# Altium schematic sheet TK510_Spenningsforsyninger.SchDoc
size A3
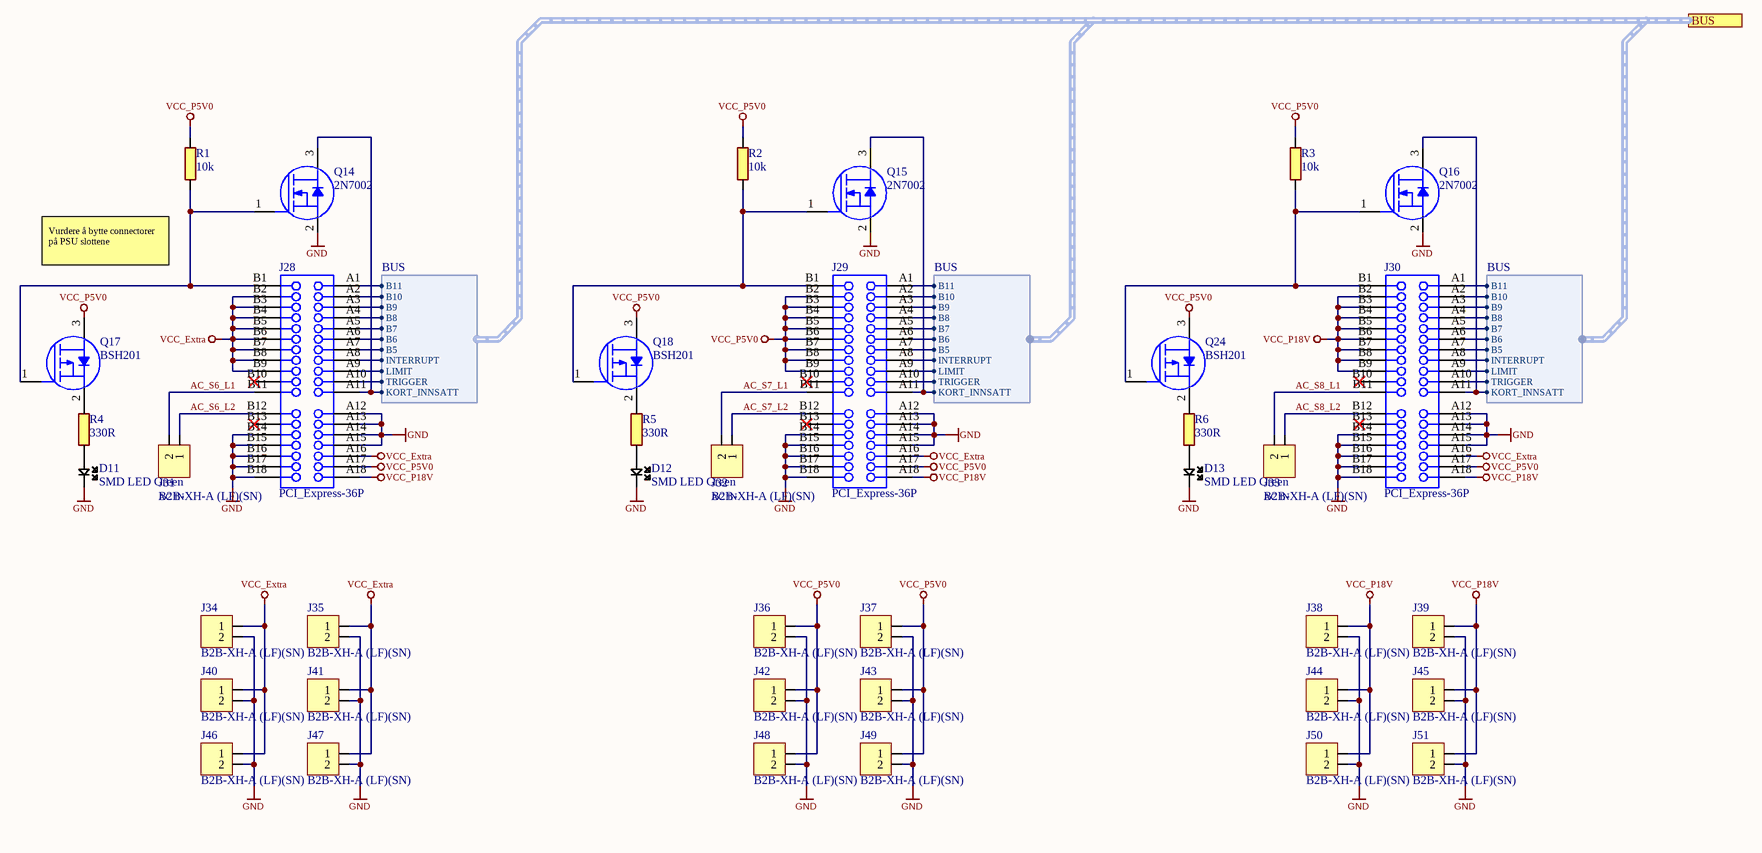
[diagram p0: TK510_Spenningsforsyninger.SchDoc]

## Parts
D11  SMD LED Green  [I_LEDC0603(1608)_N]
D12  SMD LED Green  [I_LEDC0603(1608)_N]
D13  SMD LED Green  [I_LEDC0603(1608)_N]
J28  PCI_Express-36P  [PCI_Express-36P]
J29  PCI_Express-36P  [PCI_Express-36P]
J30  PCI_Express-36P  [PCI_Express-36P]
J31  B2B-XH-A (LF)(SN)  [JST_2P]
J32  B2B-XH-A (LF)(SN)  [JST_2P]
J33  B2B-XH-A (LF)(SN)  [JST_2P]
J34  B2B-XH-A (LF)(SN)  [JST_2P]
J35  B2B-XH-A (LF)(SN)  [JST_2P]
J36  B2B-XH-A (LF)(SN)  [JST_2P]
J37  B2B-XH-A (LF)(SN)  [JST_2P]
J38  B2B-XH-A (LF)(SN)  [JST_2P]
J39  B2B-XH-A (LF)(SN)  [JST_2P]
J40  B2B-XH-A (LF)(SN)  [JST_2P]
J41  B2B-XH-A (LF)(SN)  [JST_2P]
J42  B2B-XH-A (LF)(SN)  [JST_2P]
J43  B2B-XH-A (LF)(SN)  [JST_2P]
J44  B2B-XH-A (LF)(SN)  [JST_2P]
J45  B2B-XH-A (LF)(SN)  [JST_2P]
J46  B2B-XH-A (LF)(SN)  [JST_2P]
J47  B2B-XH-A (LF)(SN)  [JST_2P]
J48  B2B-XH-A (LF)(SN)  [JST_2P]
J49  B2B-XH-A (LF)(SN)  [JST_2P]
J50  B2B-XH-A (LF)(SN)  [JST_2P]
J51  B2B-XH-A (LF)(SN)  [JST_2P]
Q14  2N7002  [SOT323_N]
Q15  2N7002  [SOT323_N]
Q16  2N7002  [SOT323_N]
Q17  BSH201  [SOT23-3_N]
Q18  BSH201  [SOT23-3_N]
Q24  BSH201  [SOT23-3_N]
R1  10k  [RESC0603(1608)_N]
R2  10k  [RESC0603(1608)_N]
R3  10k  [RESC0603(1608)_N]
R4  330R  [RESC0603(1608)_N]
R5  330R  [RESC0603(1608)_N]
R6  330R  [RESC0603(1608)_N]

## Ports
BUS (harness BUS)

## Harnesses
BUS: KORT_INNSATT, TRIGGER, LIMIT, INTERRUPT, B5, B6, B7, B8, B9, B10, B11

## Nets
GND: D11.2 D12.2 D13.2 J28.A12 J28.A13 J28.A14 J28.A15 J28.B14 J28.B15 J28.B16 J28.B17 J28.B18 J29.A12 J29.A13 J29.A14 J29.A15 J29.B14 J29.B15 J29.B16 J29.B17 J29.B18 J30.A12 J30.A13 J30.A14 J30.A15 J30.B14 J30.B15 J30.B16 J30.B17 J30.B18 J34.2 J35.2 J36.2 J37.2 J38.2 J39.2 J40.2 J41.2 J42.2 J43.2 J44.2 J45.2 J46.2 J47.2 J48.2 J49.2 J50.2 J51.2 Q14.2(Source) Q15.2(Source) Q16.2(Source)
VCC_Extra: J28.A16 J28.B2 J28.B3 J28.B4 J28.B5 J28.B6 J28.B7 J28.B8 J28.B9 J29.A16 J30.A16 J34.1 J35.1 J40.1 J41.1 J46.1 J47.1
VCC_P5V0: J28.A17 J29.A17 J29.B2 J29.B3 J29.B4 J29.B5 J29.B6 J29.B7 J29.B8 J29.B9 J30.A17 J36.1 J37.1 J42.1 J43.1 J48.1 J49.1 Q17.3(Drain) Q18.3(Drain) Q24.3(Drain) R1.2 R2.2 R3.2
VCC_P18V: J28.A18 J29.A18 J30.A18 J30.B2 J30.B3 J30.B4 J30.B5 J30.B6 J30.B7 J30.B8 J30.B9 J38.1 J39.1 J44.1 J45.1 J50.1 J51.1
AC_S6_L1: J28.B11 J31.2
AC_S6_L2: J28.B12 J31.1
AC_S7_L1: J29.B11 J32.2
AC_S7_L2: J29.B12 J32.1
AC_S8_L1: J30.B11 J33.2
AC_S8_L2: J30.B12 J33.1
NetD11_1: D11.1 R4.1
NetD12_1: D12.1 R5.1
NetD13_1: D13.1 R6.1
NetJ28_A1: J28.A1 J29.A1 J30.A1 ; port BUS.B11
NetJ28_A2: J28.A2 J29.A2 J30.A2 ; port BUS.B10
NetJ28_A3: J28.A3 J29.A3 J30.A3 ; port BUS.B9
NetJ28_A4: J28.A4 J29.A4 J30.A4 ; port BUS.B8
NetJ28_A5: J28.A5 J29.A5 J30.A5 ; port BUS.B7
NetJ28_A6: J28.A6 J29.A6 J30.A6 ; port BUS.B6
NetJ28_A7: J28.A7 J29.A7 J30.A7 ; port BUS.B5
NetJ28_A8: J28.A8 J29.A8 J30.A8 ; port BUS.INTERRUPT
NetJ28_A9: J28.A9 J29.A9 J30.A9 ; port BUS.LIMIT
NetJ28_A10: J28.A10 J29.A10 J30.A10 ; port BUS.TRIGGER
NetJ28_A11: J28.A11 J29.A11 J30.A11 Q14.3(Drain) Q15.3(Drain) Q16.3(Drain) ; port BUS.KORT_INNSATT
NetJ28_B1: J28.B1 Q14.1(Gate) Q17.1(Gate) R1.1
NetJ29_B1: J29.B1 Q15.1(Gate) Q18.1(Gate) R2.1
NetJ30_B1: J30.B1 Q16.1(Gate) Q24.1(Gate) R3.1
NetQ17_2: Q17.2(Source) R4.2
NetQ18_2: Q18.2(Source) R5.2
NetQ24_2: Q24.2(Source) R6.2

Not connected (* = marked no-connect by the designer): J28 B10* B13*; J29 B10* B13*; J30 B10* B13*

## Notes on the sheet
- (near R1) Vurdere å bytte connectorer på PSU slottene
- (near J31) AC IN
- (near J32) AC IN
- (near J33) AC IN
- Size:
- Date:
- Title:
- A3
- Revision:
- Sheet
- of
- Author:
- File:

## Library data of the parts
D11-D13 = 3654: SMD; pakke_opprettet_av: 815; pris: 1; nokkelord: diode, led, lys, grønn; pakketype: 0603; id: 3654; rad: 0; rom: OV; lager_type: Fremlager; hylle: 6; antall: 1500; produsent: ebay(Litelight); komponenttype: 9; navn: SMD LED Green; pakke_opprettet: 06/07/2014 18:55:44; symbol_opprettet_av: 815; symbol_opprettet: 06/07/2014 18:59:47; dybde: 0
J28-J30 = 3222: pakke_opprettet_av: 815; leverandor_varenr: 1144435; pris: 16; nokkelord: Card-edge; pakketype: TH; produsent: FCI; leverandor: Farnell; id: 3222; komponenttype: 11; navn: PCI_Express-36P; pakke_opprettet: 06/07/2014 17:26:47; symbol_opprettet_av: 815; symbol_opprettet: 06/07/2014 17:26:37
J31-J51 = 4043: JST 2pin (pris pr. stk.); pakke_opprettet_av: 815; pris: 2; nokkelord: Connector, Kontakt; pakketype: TH; id: 4043; rad: 3; rom: OV; lager_type: Fremlager; dybde: 0; hylle: 6; antall: 120; leverandor_varenr: 1516276; leverandor: Farnell; komponenttype: 11; navn: B2B-XH-A (LF)(SN); pakke_opprettet: 28/06/2014 18:25:03; symbol_opprettet_av: 815; symbol_opprettet: 28/06/2014 15:33:17; produsent: JST
Q14-Q16 = 3075: N-Channel MOSFET 300mA; id: 3075; rad: 2; rom: OV; lager_type: Fremlager; dybde: 0; hylle: 3; antall: 810; pakke_opprettet_av: 1165; symbol_opprettet_av: 774; leverandor_varenr: 1829184; pris: 1; leverandor: Farnell; pakketype: SOT-323; komponenttype: 4; pakke_opprettet: 12/05/2018 20:42:12; symbol_opprettet: 11/07/2014 23:17:04; navn: 2N7002
Q17 Q18 Q24 = 3085: P-Channel MOSFET 300mA; pakke_opprettet_av: 815; symbol_opprettet_av: 1150; leverandor_varenr: 1758073; pris: 3; pakketype: SOT; produsent: NXP Semiconductors; leverandor: Farnell; id: 3085; rom: OV; lager_type: Fremlager; dybde: 0; antall: 51; komponenttype: 4; Status: New; navn: BSH201; pakke_opprettet: 08/07/2014 20:37:25; symbol_opprettet: 14/09/2016 17:47:57; rad: 3; hylle: 3
R1-R3 = 5264: 0.1W 1% Thick film resistor; rad: 0; rom: OV; lager_type: Fremlager; dybde: 72; hylle: 2; antall: 4; pakke_opprettet_av: 815; nokkelord: Resistor Motstand; pakketype: 0603; id: 5264; leverandor_varenr: 2447230; produsent: Multicomp; leverandor: Farnell; komponenttype: 1; navn: 10k; pakke_opprettet: 08/07/2014 21:15:30; symbol_opprettet_av: 815; symbol_opprettet: 08/07/2014 21:16:33; pris: 0
R4-R6 = 5343: 0.1W 1% Thick film resistor; rad: 0; rom: OV; lager_type: Fremlager; dybde: 36; hylle: 2; antall: 45; pakke_opprettet_av: 815; nokkelord: Resistor Motstand; pakketype: 0603; id: 5343; leverandor_varenr: 2447339; produsent: Multicomp; leverandor: Farnell; komponenttype: 1; navn: 330R; pakke_opprettet: 08/07/2014 21:15:30; symbol_opprettet_av: 815; symbol_opprettet: 08/07/2014 21:16:33; pris: 0